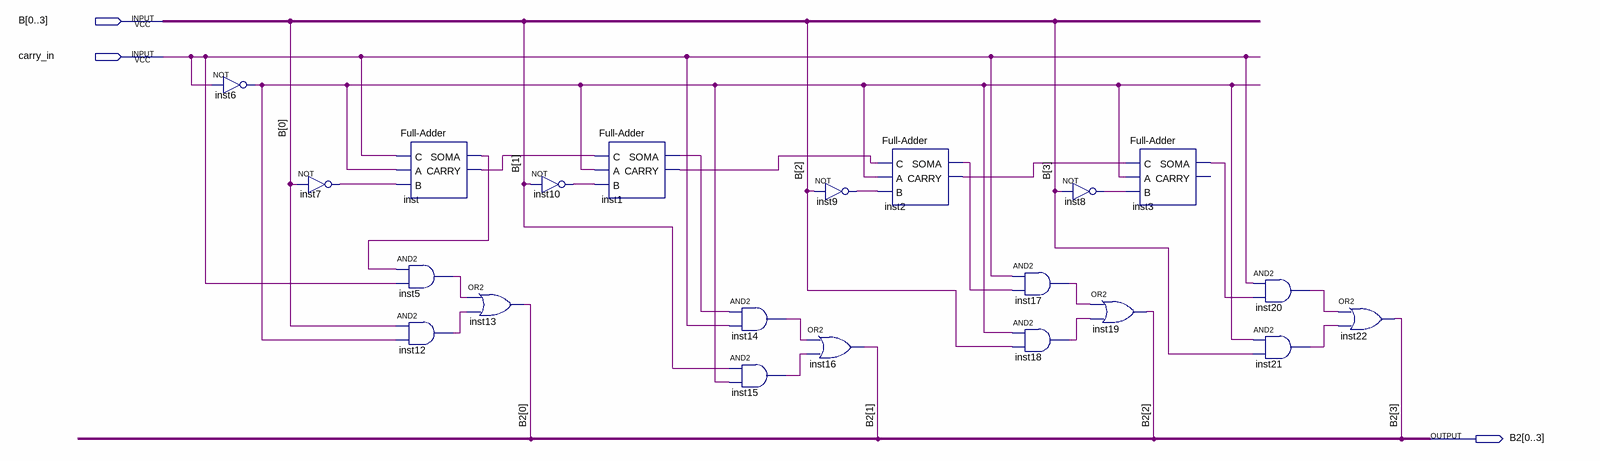
[diagram p0: schematic sheet]
// Quartus schematic Complemento4bits_novo.bdf as structural Verilog: 21 symbols, 3 pins
module Complemento4bits_novo (
  input  [0:3] B,
  input  carry_in,
  output [0:3] B2
);

  wire inst1_carry, inst1_soma, inst2_carry, inst2_soma, inst3_soma, inst5_out, inst6_out, inst7_out,
       inst8_out, inst9_out, inst10_out, inst12_out, inst14_out, inst15_out, inst17_out, inst18_out,
       inst20_out, inst21_out, inst_carry, inst_soma;

  not inst6 (inst6_out, carry_in);
  not inst7 (inst7_out, B[0]);
  \Full-Adder  inst (.C(carry_in), .A(inst6_out), .B(inst7_out), .SOMA(inst_soma), .CARRY(inst_carry));
  and inst5 (inst5_out, inst_soma, carry_in);
  and inst12 (inst12_out, B[0], inst6_out);
  or inst13 (B2[0], inst5_out, inst12_out);
  not inst10 (inst10_out, B[1]);
  \Full-Adder  inst1 (.C(inst_carry), .A(inst6_out), .B(inst10_out), .SOMA(inst1_soma), .CARRY(inst1_carry));
  and inst14 (inst14_out, inst1_soma, carry_in);
  and inst15 (inst15_out, B[1], inst6_out);
  not inst9 (inst9_out, B[2]);
  or inst16 (B2[1], inst14_out, inst15_out);
  \Full-Adder  inst2 (.C(inst1_carry), .A(inst6_out), .B(inst9_out), .SOMA(inst2_soma), .CARRY(inst2_carry));
  not inst8 (inst8_out, B[3]);
  and inst17 (inst17_out, carry_in, inst2_soma);
  and inst18 (inst18_out, inst6_out, B[2]);
  or inst19 (B2[2], inst17_out, inst18_out);
  \Full-Adder  inst3 (.C(inst2_carry), .A(inst6_out), .B(inst8_out), .SOMA(inst3_soma));  // open: CARRY
  and inst20 (inst20_out, carry_in, inst3_soma);
  and inst21 (inst21_out, inst6_out, B[3]);
  or inst22 (B2[3], inst20_out, inst21_out);
endmodule
